# Altium schematic sheet Dual_signal_switch.SchDoc
size A3; Organization: Altium Limited; Address1: L3, 12a Rodborough Rd; Address2: Frenchs Forest; Address3: NSW; Address4: Australia 2086
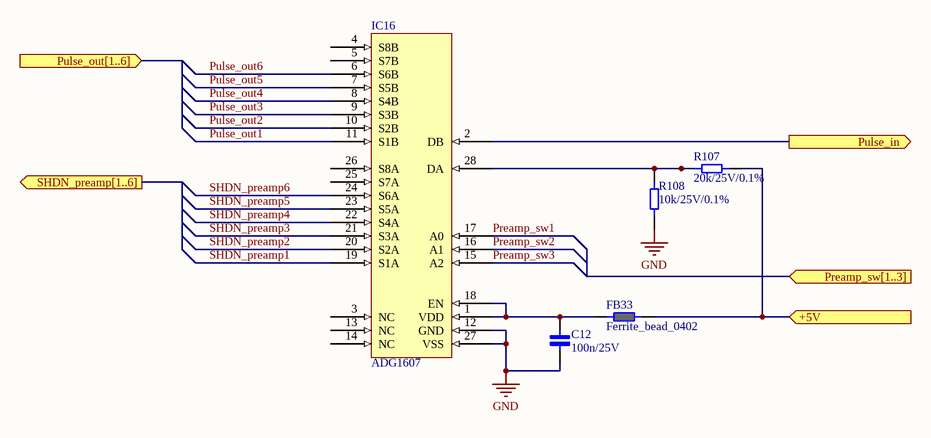
[diagram p0: Dual_signal_switch.SchDoc]

## Parts
C12  100n/25V  [Cap_0402]
FB33  Ferrite_bead_0402  [FERRITE_0402]
IC16  ADG1607  [TSOP28]
R107  20k/25V/0.1%  [RES_0402]
R108  10k/25V/0.1%  [RES_0402]

## Ports
+5V (in), Preamp_sw[1..3] (in), Pulse_in (out), Pulse_out[1..6] (in), SHDN_preamp[1..6] (out)

## Nets
GND: C12.1 IC16.12(GND) IC16.27(VSS) R108.1
+5V: FB33.2 R107.2 ; port +5V
Preamp_sw1: IC16.17(A0)
Preamp_sw2: IC16.16(A1)
Preamp_sw3: IC16.15(A2)
Pulse_in: IC16.2(DB) ; port Pulse_in
Pulse_out1: IC16.11(S1B)
Pulse_out2: IC16.10(S2B)
Pulse_out3: IC16.9(S3B)
Pulse_out4: IC16.8(S4B)
Pulse_out5: IC16.7(S5B)
Pulse_out6: IC16.6(S6B)
SHDN_preamp1: IC16.19(S1A)
SHDN_preamp2: IC16.20(S2A)
SHDN_preamp3: IC16.21(S3A)
SHDN_preamp4: IC16.22(S4A)
SHDN_preamp5: IC16.23(S5A)
SHDN_preamp6: IC16.24(S6A)
NetC12_2: C12.2 FB33.1 IC16.1(VDD) IC16.18(EN)
NetIC16_28: IC16.28(DA) R107.1 R108.2

Not connected (* = marked no-connect by the designer): IC16 3(NC) 4(S8B) 5(S7B) 13(NC) 14(NC) 25(S7A) 26(S8A)

## Notes on the sheet
- Title
- Size:
- Date:
- A3
- Number:
- Time:
- Revision:
- Sheet
- of
- File:

## Library data of the parts
C12 = Cap_0402_100n: Ceramic Capacitor 100n / 0402 / 25V / ±5%, Wurth Elektronik MLCC; ComponentLink1Description: New link; ComponentLink1URL: https://www.we-online.com/catalog/en/WCAP-CSGP-25VDC
FB33 = Ferrite_bead_0402: Ferrite bead, wurth 74269241102
IC16 = ADG1607: 8-ch MUX; ComponentLink1Description: New link; ComponentLink1URL: https://pl.mouser.com/datasheet/2/609/ADG1606_1607-1502923.pdf
R107 = Res_0402_20k: Vishay, thin film resistor 20k/25V/0.1%
R108 = Res_0402_10k: Vishay, thin film resistor 10k/25V/0.1%